# EAGLE schematic Speaker_shield (EAGLE 5.11)

## Sheet 1 of 3
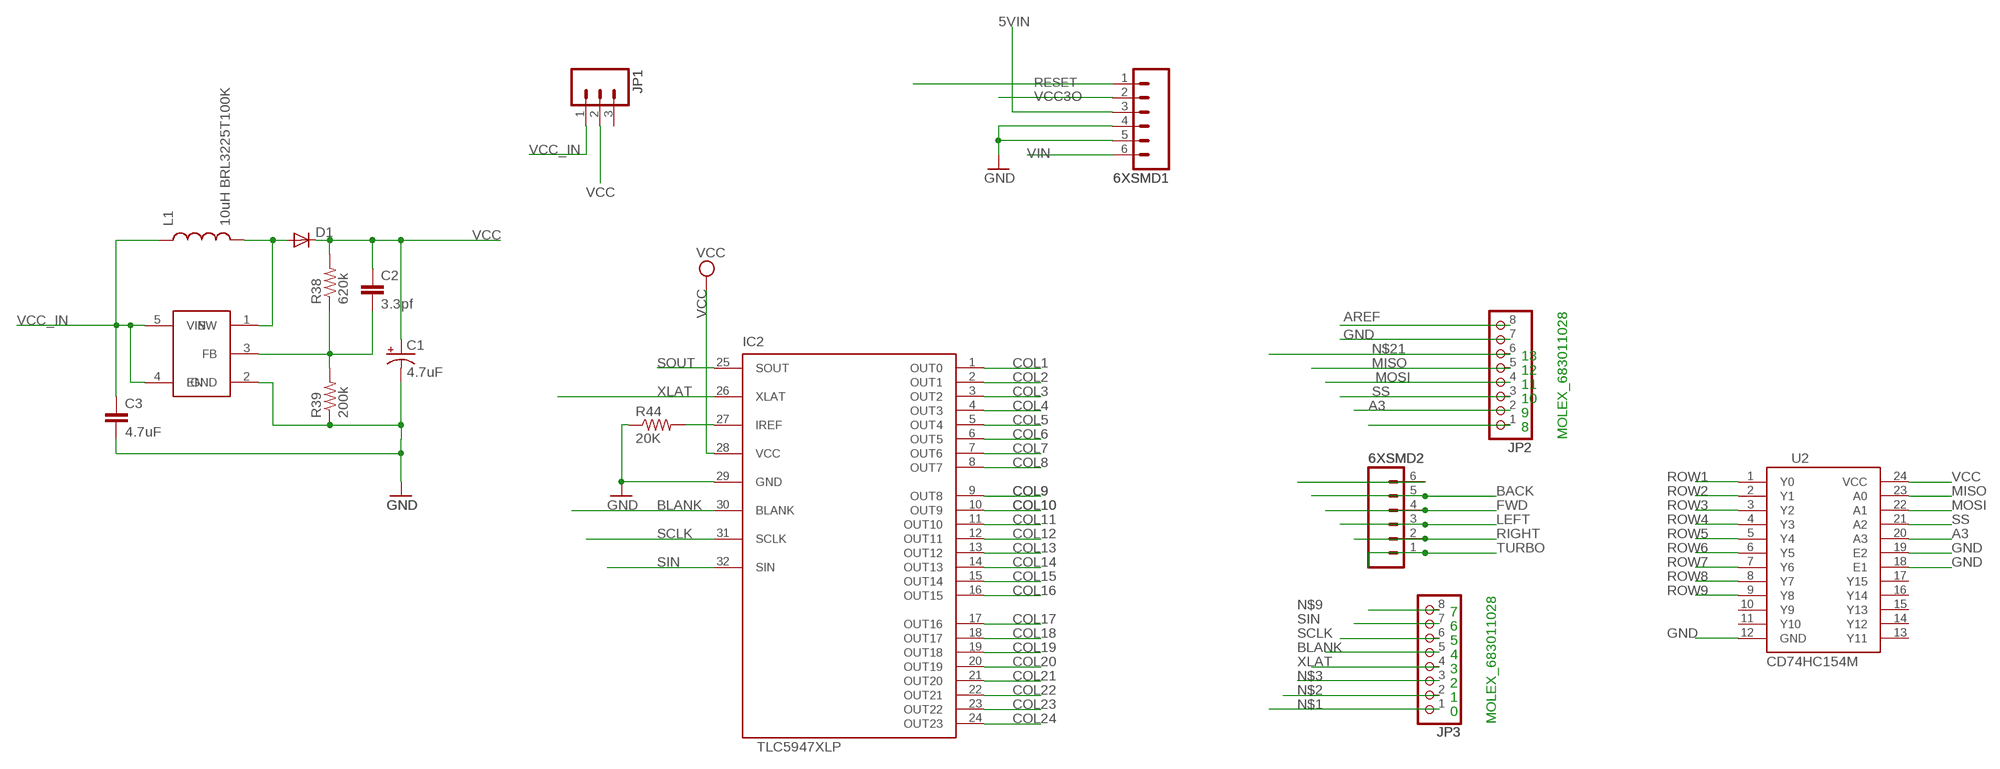
[diagram p0: schematic, sheet 1]

### Parts
6XSMD1  M06  [95293-401A06LF]
6XSMD2  M06  [95293-401A06LF]
C1  4.7uF  CAP_POL1206-KIT  [EIA3216-KIT]
C2  3.3pf  CAP0805  [0805]
C3  4.7uF  CAP0805  [0805]
D1  DIODESMA-ALT  [SMA-DIODE_ALT]
IC1  TPS61040  [SOT-23]
IC2  TLC5947XLP  [QFN32_XLP]
JP1  M03FEMALESMD  [1X3SMD]
JP2  PINHD-1X8SMD  [1X08SMD]
JP3  PINHD-1X8SMD  [1X08SMD]
L1  10uH BRL3225T100K  INDUCTOR1210  [1210]
R38  620k  RESISTOR0805-RES  [0805]
R39  200k  RESISTOR0805-RES  [0805]
R44  20K  R-US_R0805W  [R0805W]
U2  CD74HC154M  [SO-24DW]

### Nets
5VIN: 6XSMD1.3
A3: JP2.2 U2.20(A3)
AREF [aref]: JP2.8
BACK: 6XSMD2.5
BLANK: IC2.30(BLANK) JP3.5
COL1: IC2.1(OUT0) ; also sheet 2
COL2: IC2.2(OUT1) ; also sheet 2,3
COL3: IC2.3(OUT2) ; also sheet 2,3
COL4: IC2.4(OUT3) ; also sheet 2
COL5: IC2.5(OUT4) ; also sheet 2,3
COL6: IC2.6(OUT5) ; also sheet 2,3
COL7: IC2.7(OUT6) ; also sheet 2,3
COL8: IC2.8(OUT7) ; also sheet 2,3
COL9: IC2.9(OUT8) ; also sheet 2,3
COL10: IC2.10(OUT9) ; also sheet 2,3
COL11: IC2.11(OUT10) ; also sheet 2
COL12: IC2.12(OUT11) ; also sheet 2
COL13: IC2.13(OUT12) ; also sheet 2,3
COL14: IC2.14(OUT13) ; also sheet 2,3
COL15: IC2.15(OUT14) ; also sheet 2,3
COL16: IC2.16(OUT15) ; also sheet 2
COL17: IC2.17(OUT16)
COL18: IC2.18(OUT17)
COL19: IC2.19(OUT18)
COL20: IC2.20(OUT19)
COL21: IC2.21(OUT20)
COL22: IC2.22(OUT21)
COL23: IC2.23(OUT22)
COL24: IC2.24(OUT23)
FWD: 6XSMD2.4
GND: 6XSMD1.4 6XSMD1.5 C1.C(-) C3.2 IC1.2(GND) IC2.29(GND) JP2.7 R39.1 R44.1 U2.12(GND) U2.18(E1) U2.19(E2) ; also sheet 3
LEFT: 6XSMD2.3
MISO: JP2.5 U2.23(A0)
MOSI: JP2.4 U2.22(A1)
N$1: JP3.1
N$2: JP3.2
N$3: JP3.3
N$9: JP3.8
N$13: IC2.27(IREF) R44.2
N$15: D1.A IC1.1(SW) L1.2
N$17: C2.2 IC1.3(FB) R38.1 R39.2
N$21: JP2.6
N$24: 6XSMD2.6
N$25: JP2.1
RESET: 6XSMD1.1
RIGHT: 6XSMD2.2
ROW1: U2.1(Y0) ; also sheet 2
ROW2: U2.2(Y1) ; also sheet 2
ROW3: U2.3(Y2) ; also sheet 2
ROW4: U2.4(Y3) ; also sheet 2
ROW5: U2.5(Y4) ; also sheet 2
ROW6: U2.6(Y5) ; also sheet 2
ROW7: U2.7(Y6) ; also sheet 2
ROW8: U2.8(Y7) ; also sheet 2
ROW9: U2.9(Y8) ; also sheet 2
SCLK: IC2.31(SCLK) JP3.6
SIN: IC2.32(SIN) JP3.7
SOUT: IC2.25(SOUT)
SS: JP2.3 U2.21(A2)
TURBO: 6XSMD2.1
VCC: C1.A(+) C2.1 D1.C IC2.28(VCC) JP1.2 R38.2 U2.24(VCC) ; also sheet 2
VCC3O: 6XSMD1.2
VCC_IN: C3.1 IC1.4(EN) IC1.5(VIN) JP1.1 L1.1
VIN [power]: 6XSMD1.6
XLAT: IC2.26(XLAT) JP3.4
Unconnected: JP1.3 U2.10(Y9) U2.11(Y10) U2.13(Y11) U2.14(Y12) U2.15(Y13) U2.16(Y14) U2.17(Y15)

### Notes on the sheet
- 13
- 12
- 11
- 10
- 9
- 8
- MOLEX_683011028
- 7
- 6
- 5
- 4
- 3
- 2
- 1
- 0
- MOLEX_683011028

## Sheet 2 of 3
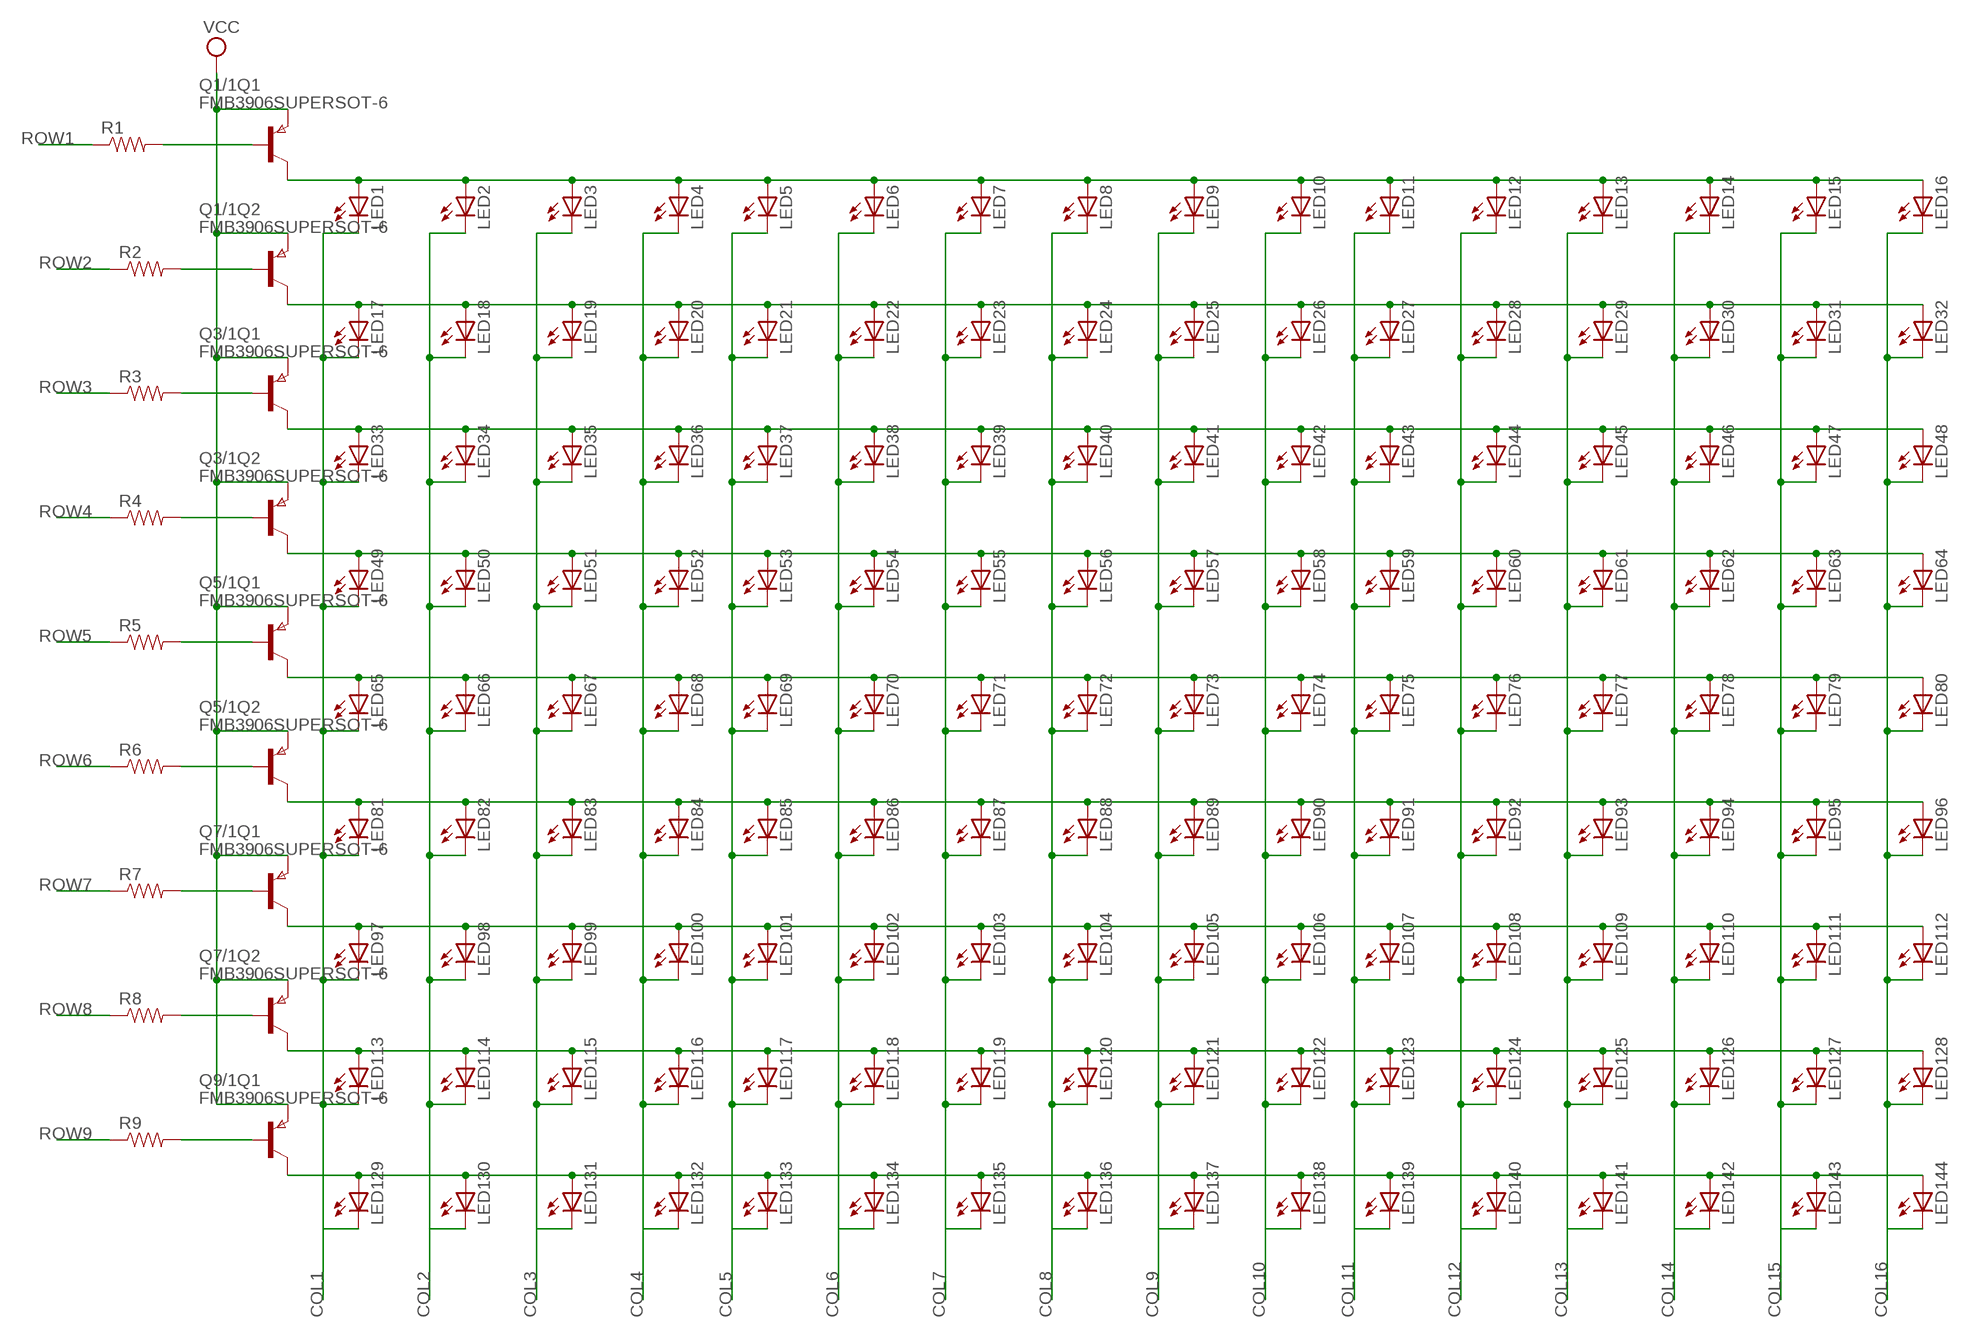
[diagram p1: schematic, sheet 2]

### Parts
LED1  NSL_SPARKFUN_LED1206  [NSL_SPARKFUN_LED-1206]
LED2  NSL_SPARKFUN_LED1206  [NSL_SPARKFUN_LED-1206]
LED3  NSL_SPARKFUN_LED1206  [NSL_SPARKFUN_LED-1206]
LED4  NSL_SPARKFUN_LED1206  [NSL_SPARKFUN_LED-1206]
LED5  NSL_SPARKFUN_LED1206  [NSL_SPARKFUN_LED-1206]
LED6  NSL_SPARKFUN_LED1206  [NSL_SPARKFUN_LED-1206]
LED7  NSL_SPARKFUN_LED1206  [NSL_SPARKFUN_LED-1206]
LED8  NSL_SPARKFUN_LED1206  [NSL_SPARKFUN_LED-1206]
LED9  NSL_SPARKFUN_LED1206  [NSL_SPARKFUN_LED-1206]
LED10  NSL_SPARKFUN_LED1206  [NSL_SPARKFUN_LED-1206]
LED11  NSL_SPARKFUN_LED1206  [NSL_SPARKFUN_LED-1206]
LED12  NSL_SPARKFUN_LED1206  [NSL_SPARKFUN_LED-1206]
LED13  NSL_SPARKFUN_LED1206  [NSL_SPARKFUN_LED-1206]
LED14  NSL_SPARKFUN_LED1206  [NSL_SPARKFUN_LED-1206]
LED15  NSL_SPARKFUN_LED1206  [NSL_SPARKFUN_LED-1206]
LED16  NSL_SPARKFUN_LED1206  [NSL_SPARKFUN_LED-1206]
LED17  NSL_SPARKFUN_LED1206  [NSL_SPARKFUN_LED-1206]
LED18  NSL_SPARKFUN_LED1206  [NSL_SPARKFUN_LED-1206]
LED19  NSL_SPARKFUN_LED1206  [NSL_SPARKFUN_LED-1206]
LED20  NSL_SPARKFUN_LED1206  [NSL_SPARKFUN_LED-1206]
LED21  NSL_SPARKFUN_LED1206  [NSL_SPARKFUN_LED-1206]
LED22  NSL_SPARKFUN_LED1206  [NSL_SPARKFUN_LED-1206]
LED23  NSL_SPARKFUN_LED1206  [NSL_SPARKFUN_LED-1206]
LED24  NSL_SPARKFUN_LED1206  [NSL_SPARKFUN_LED-1206]
LED25  NSL_SPARKFUN_LED1206  [NSL_SPARKFUN_LED-1206]
LED26  NSL_SPARKFUN_LED1206  [NSL_SPARKFUN_LED-1206]
LED27  NSL_SPARKFUN_LED1206  [NSL_SPARKFUN_LED-1206]
LED28  NSL_SPARKFUN_LED1206  [NSL_SPARKFUN_LED-1206]
LED29  NSL_SPARKFUN_LED1206  [NSL_SPARKFUN_LED-1206]
LED30  NSL_SPARKFUN_LED1206  [NSL_SPARKFUN_LED-1206]
LED31  NSL_SPARKFUN_LED1206  [NSL_SPARKFUN_LED-1206]
LED32  NSL_SPARKFUN_LED1206  [NSL_SPARKFUN_LED-1206]
LED33  NSL_SPARKFUN_LED1206  [NSL_SPARKFUN_LED-1206]
LED34  NSL_SPARKFUN_LED1206  [NSL_SPARKFUN_LED-1206]
LED35  NSL_SPARKFUN_LED1206  [NSL_SPARKFUN_LED-1206]
LED36  NSL_SPARKFUN_LED1206  [NSL_SPARKFUN_LED-1206]
LED37  NSL_SPARKFUN_LED1206  [NSL_SPARKFUN_LED-1206]
LED38  NSL_SPARKFUN_LED1206  [NSL_SPARKFUN_LED-1206]
LED39  NSL_SPARKFUN_LED1206  [NSL_SPARKFUN_LED-1206]
LED40  NSL_SPARKFUN_LED1206  [NSL_SPARKFUN_LED-1206]
LED41  NSL_SPARKFUN_LED1206  [NSL_SPARKFUN_LED-1206]
LED42  NSL_SPARKFUN_LED1206  [NSL_SPARKFUN_LED-1206]
LED43  NSL_SPARKFUN_LED1206  [NSL_SPARKFUN_LED-1206]
LED44  NSL_SPARKFUN_LED1206  [NSL_SPARKFUN_LED-1206]
LED45  NSL_SPARKFUN_LED1206  [NSL_SPARKFUN_LED-1206]
LED46  NSL_SPARKFUN_LED1206  [NSL_SPARKFUN_LED-1206]
LED47  NSL_SPARKFUN_LED1206  [NSL_SPARKFUN_LED-1206]
LED48  NSL_SPARKFUN_LED1206  [NSL_SPARKFUN_LED-1206]
LED49  NSL_SPARKFUN_LED1206  [NSL_SPARKFUN_LED-1206]
LED50  NSL_SPARKFUN_LED1206  [NSL_SPARKFUN_LED-1206]
LED51  NSL_SPARKFUN_LED1206  [NSL_SPARKFUN_LED-1206]
LED52  NSL_SPARKFUN_LED1206  [NSL_SPARKFUN_LED-1206]
LED53  NSL_SPARKFUN_LED1206  [NSL_SPARKFUN_LED-1206]
LED54  NSL_SPARKFUN_LED1206  [NSL_SPARKFUN_LED-1206]
LED55  NSL_SPARKFUN_LED1206  [NSL_SPARKFUN_LED-1206]
LED56  NSL_SPARKFUN_LED1206  [NSL_SPARKFUN_LED-1206]
LED57  NSL_SPARKFUN_LED1206  [NSL_SPARKFUN_LED-1206]
LED58  NSL_SPARKFUN_LED1206  [NSL_SPARKFUN_LED-1206]
LED59  NSL_SPARKFUN_LED1206  [NSL_SPARKFUN_LED-1206]
LED60  NSL_SPARKFUN_LED1206  [NSL_SPARKFUN_LED-1206]
LED61  NSL_SPARKFUN_LED1206  [NSL_SPARKFUN_LED-1206]
LED62  NSL_SPARKFUN_LED1206  [NSL_SPARKFUN_LED-1206]
LED63  NSL_SPARKFUN_LED1206  [NSL_SPARKFUN_LED-1206]
LED64  NSL_SPARKFUN_LED1206  [NSL_SPARKFUN_LED-1206]
LED65  NSL_SPARKFUN_LED1206  [NSL_SPARKFUN_LED-1206]
LED66  NSL_SPARKFUN_LED1206  [NSL_SPARKFUN_LED-1206]
LED67  NSL_SPARKFUN_LED1206  [NSL_SPARKFUN_LED-1206]
LED68  NSL_SPARKFUN_LED1206  [NSL_SPARKFUN_LED-1206]
LED69  NSL_SPARKFUN_LED1206  [NSL_SPARKFUN_LED-1206]
LED70  NSL_SPARKFUN_LED1206  [NSL_SPARKFUN_LED-1206]
LED71  NSL_SPARKFUN_LED1206  [NSL_SPARKFUN_LED-1206]
LED72  NSL_SPARKFUN_LED1206  [NSL_SPARKFUN_LED-1206]
LED73  NSL_SPARKFUN_LED1206  [NSL_SPARKFUN_LED-1206]
LED74  NSL_SPARKFUN_LED1206  [NSL_SPARKFUN_LED-1206]
LED75  NSL_SPARKFUN_LED1206  [NSL_SPARKFUN_LED-1206]
LED76  NSL_SPARKFUN_LED1206  [NSL_SPARKFUN_LED-1206]
LED77  NSL_SPARKFUN_LED1206  [NSL_SPARKFUN_LED-1206]
LED78  NSL_SPARKFUN_LED1206  [NSL_SPARKFUN_LED-1206]
LED79  NSL_SPARKFUN_LED1206  [NSL_SPARKFUN_LED-1206]
LED80  NSL_SPARKFUN_LED1206  [NSL_SPARKFUN_LED-1206]
LED81  NSL_SPARKFUN_LED1206  [NSL_SPARKFUN_LED-1206]
LED82  NSL_SPARKFUN_LED1206  [NSL_SPARKFUN_LED-1206]
LED83  NSL_SPARKFUN_LED1206  [NSL_SPARKFUN_LED-1206]
LED84  NSL_SPARKFUN_LED1206  [NSL_SPARKFUN_LED-1206]
LED85  NSL_SPARKFUN_LED1206  [NSL_SPARKFUN_LED-1206]
LED86  NSL_SPARKFUN_LED1206  [NSL_SPARKFUN_LED-1206]
LED87  NSL_SPARKFUN_LED1206  [NSL_SPARKFUN_LED-1206]
LED88  NSL_SPARKFUN_LED1206  [NSL_SPARKFUN_LED-1206]
LED89  NSL_SPARKFUN_LED1206  [NSL_SPARKFUN_LED-1206]
LED90  NSL_SPARKFUN_LED1206  [NSL_SPARKFUN_LED-1206]
LED91  NSL_SPARKFUN_LED1206  [NSL_SPARKFUN_LED-1206]
LED92  NSL_SPARKFUN_LED1206  [NSL_SPARKFUN_LED-1206]
LED93  NSL_SPARKFUN_LED1206  [NSL_SPARKFUN_LED-1206]
LED94  NSL_SPARKFUN_LED1206  [NSL_SPARKFUN_LED-1206]
LED95  NSL_SPARKFUN_LED1206  [NSL_SPARKFUN_LED-1206]
LED96  NSL_SPARKFUN_LED1206  [NSL_SPARKFUN_LED-1206]
LED97  NSL_SPARKFUN_LED1206  [NSL_SPARKFUN_LED-1206]
LED98  NSL_SPARKFUN_LED1206  [NSL_SPARKFUN_LED-1206]
LED99  NSL_SPARKFUN_LED1206  [NSL_SPARKFUN_LED-1206]
LED100  NSL_SPARKFUN_LED1206  [NSL_SPARKFUN_LED-1206]
LED101  NSL_SPARKFUN_LED1206  [NSL_SPARKFUN_LED-1206]
LED102  NSL_SPARKFUN_LED1206  [NSL_SPARKFUN_LED-1206]
LED103  NSL_SPARKFUN_LED1206  [NSL_SPARKFUN_LED-1206]
LED104  NSL_SPARKFUN_LED1206  [NSL_SPARKFUN_LED-1206]
LED105  NSL_SPARKFUN_LED1206  [NSL_SPARKFUN_LED-1206]
LED106  NSL_SPARKFUN_LED1206  [NSL_SPARKFUN_LED-1206]
LED107  NSL_SPARKFUN_LED1206  [NSL_SPARKFUN_LED-1206]
LED108  NSL_SPARKFUN_LED1206  [NSL_SPARKFUN_LED-1206]
LED109  NSL_SPARKFUN_LED1206  [NSL_SPARKFUN_LED-1206]
LED110  NSL_SPARKFUN_LED1206  [NSL_SPARKFUN_LED-1206]
LED111  NSL_SPARKFUN_LED1206  [NSL_SPARKFUN_LED-1206]
LED112  NSL_SPARKFUN_LED1206  [NSL_SPARKFUN_LED-1206]
LED113  NSL_SPARKFUN_LED1206  [NSL_SPARKFUN_LED-1206]
LED114  NSL_SPARKFUN_LED1206  [NSL_SPARKFUN_LED-1206]
LED115  NSL_SPARKFUN_LED1206  [NSL_SPARKFUN_LED-1206]
LED116  NSL_SPARKFUN_LED1206  [NSL_SPARKFUN_LED-1206]
LED117  NSL_SPARKFUN_LED1206  [NSL_SPARKFUN_LED-1206]
LED118  NSL_SPARKFUN_LED1206  [NSL_SPARKFUN_LED-1206]
LED119  NSL_SPARKFUN_LED1206  [NSL_SPARKFUN_LED-1206]
LED120  NSL_SPARKFUN_LED1206  [NSL_SPARKFUN_LED-1206]
LED121  NSL_SPARKFUN_LED1206  [NSL_SPARKFUN_LED-1206]
LED122  NSL_SPARKFUN_LED1206  [NSL_SPARKFUN_LED-1206]
LED123  NSL_SPARKFUN_LED1206  [NSL_SPARKFUN_LED-1206]
LED124  NSL_SPARKFUN_LED1206  [NSL_SPARKFUN_LED-1206]
LED125  NSL_SPARKFUN_LED1206  [NSL_SPARKFUN_LED-1206]
LED126  NSL_SPARKFUN_LED1206  [NSL_SPARKFUN_LED-1206]
LED127  NSL_SPARKFUN_LED1206  [NSL_SPARKFUN_LED-1206]
LED128  NSL_SPARKFUN_LED1206  [NSL_SPARKFUN_LED-1206]
LED129  NSL_SPARKFUN_LED1206  [NSL_SPARKFUN_LED-1206]
LED130  NSL_SPARKFUN_LED1206  [NSL_SPARKFUN_LED-1206]
LED131  NSL_SPARKFUN_LED1206  [NSL_SPARKFUN_LED-1206]
LED132  NSL_SPARKFUN_LED1206  [NSL_SPARKFUN_LED-1206]
LED133  NSL_SPARKFUN_LED1206  [NSL_SPARKFUN_LED-1206]
LED134  NSL_SPARKFUN_LED1206  [NSL_SPARKFUN_LED-1206]
LED135  NSL_SPARKFUN_LED1206  [NSL_SPARKFUN_LED-1206]
LED136  NSL_SPARKFUN_LED1206  [NSL_SPARKFUN_LED-1206]
LED137  NSL_SPARKFUN_LED1206  [NSL_SPARKFUN_LED-1206]
LED138  NSL_SPARKFUN_LED1206  [NSL_SPARKFUN_LED-1206]
LED139  NSL_SPARKFUN_LED1206  [NSL_SPARKFUN_LED-1206]
LED140  NSL_SPARKFUN_LED1206  [NSL_SPARKFUN_LED-1206]
LED141  NSL_SPARKFUN_LED1206  [NSL_SPARKFUN_LED-1206]
LED142  NSL_SPARKFUN_LED1206  [NSL_SPARKFUN_LED-1206]
LED143  NSL_SPARKFUN_LED1206  [NSL_SPARKFUN_LED-1206]
LED144  NSL_SPARKFUN_LED1206  [NSL_SPARKFUN_LED-1206]
Q1/1  FMB3906SUPERSOT-6  [SSOT-6]
Q3/1  FMB3906SUPERSOT-6  [SSOT-6]
Q5/1  FMB3906SUPERSOT-6  [SSOT-6]
Q7/1  FMB3906SUPERSOT-6  [SSOT-6]
Q9/1  FMB3906SUPERSOT-6  [SSOT-6]
R1  SPARKFUN_RESISTOR0603-RES  [SPARKFUN_0603-RES]
R2  SPARKFUN_RESISTOR0603-RES  [SPARKFUN_0603-RES]
R3  SPARKFUN_RESISTOR0603-RES  [SPARKFUN_0603-RES]
R4  SPARKFUN_RESISTOR0603-RES  [SPARKFUN_0603-RES]
R5  SPARKFUN_RESISTOR0603-RES  [SPARKFUN_0603-RES]
R6  SPARKFUN_RESISTOR0603-RES  [SPARKFUN_0603-RES]
R7  SPARKFUN_RESISTOR0603-RES  [SPARKFUN_0603-RES]
R8  SPARKFUN_RESISTOR0603-RES  [SPARKFUN_0603-RES]
R9  SPARKFUN_RESISTOR0603-RES  [SPARKFUN_0603-RES]

### Nets
COL1: LED1.C LED17.C LED33.C LED49.C LED65.C LED81.C LED97.C LED113.C LED129.C ; also sheet 1
COL2: LED2.C LED18.C LED34.C LED50.C LED66.C LED82.C LED98.C LED114.C LED130.C ; also sheet 1,3
COL3: LED3.C LED19.C LED35.C LED51.C LED67.C LED83.C LED99.C LED115.C LED131.C ; also sheet 1,3
COL4: LED4.C LED20.C LED36.C LED52.C LED68.C LED84.C LED100.C LED116.C LED132.C ; also sheet 1
COL5: LED5.C LED21.C LED37.C LED53.C LED69.C LED85.C LED101.C LED117.C LED133.C ; also sheet 1,3
COL6: LED6.C LED22.C LED38.C LED54.C LED70.C LED86.C LED102.C LED118.C LED134.C ; also sheet 1,3
COL7: LED7.C LED23.C LED39.C LED55.C LED71.C LED87.C LED103.C LED119.C LED135.C ; also sheet 1,3
COL8: LED8.C LED24.C LED40.C LED56.C LED72.C LED88.C LED104.C LED120.C LED136.C ; also sheet 1,3
COL9: LED9.C LED25.C LED41.C LED57.C LED73.C LED89.C LED105.C LED121.C LED137.C ; also sheet 1,3
COL10: LED10.C LED26.C LED42.C LED58.C LED74.C LED90.C LED106.C LED122.C LED138.C ; also sheet 1,3
COL11: LED11.C LED27.C LED43.C LED59.C LED75.C LED91.C LED107.C LED123.C LED139.C ; also sheet 1
COL12: LED12.C LED28.C LED44.C LED60.C LED76.C LED92.C LED108.C LED124.C LED140.C ; also sheet 1
COL13: LED13.C LED29.C LED45.C LED61.C LED77.C LED93.C LED109.C LED125.C LED141.C ; also sheet 1,3
COL14: LED14.C LED30.C LED46.C LED62.C LED78.C LED94.C LED110.C LED126.C LED142.C ; also sheet 1,3
COL15: LED15.C LED31.C LED47.C LED63.C LED79.C LED95.C LED111.C LED127.C LED143.C ; also sheet 1,3
COL16: LED16.C LED32.C LED48.C LED64.C LED80.C LED96.C LED112.C LED128.C LED144.C ; also sheet 1
LINE1: LED1.A LED2.A LED3.A LED4.A LED5.A LED6.A LED7.A LED8.A LED9.A LED10.A LED11.A LED12.A LED13.A LED14.A LED15.A LED16.A Q1/1.6(Q1:C)
LINE2: LED17.A LED18.A LED19.A LED20.A LED21.A LED22.A LED23.A LED24.A LED25.A LED26.A LED27.A LED28.A LED29.A LED30.A LED31.A LED32.A Q1/1.4(Q2:C)
LINE3: LED33.A LED34.A LED35.A LED36.A LED37.A LED38.A LED39.A LED40.A LED41.A LED42.A LED43.A LED44.A LED45.A LED46.A LED47.A LED48.A Q3/1.6(Q1:C)
LINE4: LED49.A LED50.A LED51.A LED52.A LED53.A LED54.A LED55.A LED56.A LED57.A LED58.A LED59.A LED60.A LED61.A LED62.A LED63.A LED64.A Q3/1.4(Q2:C)
LINE5: LED65.A LED66.A LED67.A LED68.A LED69.A LED70.A LED71.A LED72.A LED73.A LED74.A LED75.A LED76.A LED77.A LED78.A LED79.A LED80.A Q5/1.6(Q1:C)
LINE6: LED81.A LED82.A LED83.A LED84.A LED85.A LED86.A LED87.A LED88.A LED89.A LED90.A LED91.A LED92.A LED93.A LED94.A LED95.A LED96.A Q5/1.4(Q2:C)
LINE7: LED97.A LED98.A LED99.A LED100.A LED101.A LED102.A LED103.A LED104.A LED105.A LED106.A LED107.A LED108.A LED109.A LED110.A LED111.A LED112.A Q7/1.6(Q1:C)
LINE8: LED113.A LED114.A LED115.A LED116.A LED117.A LED118.A LED119.A LED120.A LED121.A LED122.A LED123.A LED124.A LED125.A LED126.A LED127.A LED128.A Q7/1.4(Q2:C)
LINE9: LED129.A LED130.A LED131.A LED132.A LED133.A LED134.A LED135.A LED136.A LED137.A LED138.A LED139.A LED140.A LED141.A LED142.A LED143.A LED144.A Q9/1.6(Q1:C)
N$4: Q1/1.1(Q1:B) R1.2
N$6: Q1/1.3(Q2:B) R2.2
N$7: Q3/1.1(Q1:B) R3.2
N$10: Q3/1.3(Q2:B) R4.2
N$11: Q5/1.1(Q1:B) R5.2
N$12: Q5/1.3(Q2:B) R6.2
N$14: Q7/1.1(Q1:B) R7.2
N$16: Q7/1.3(Q2:B) R8.2
N$18: Q9/1.1(Q1:B) R9.2
ROW1: R1.1 ; also sheet 1
ROW2: R2.1 ; also sheet 1
ROW3: R3.1 ; also sheet 1
ROW4: R4.1 ; also sheet 1
ROW5: R5.1 ; also sheet 1
ROW6: R6.1 ; also sheet 1
ROW7: R7.1 ; also sheet 1
ROW8: R8.1 ; also sheet 1
ROW9: R9.1 ; also sheet 1
VCC: Q1/1.2(Q2:E) Q1/1.5(Q1:E) Q3/1.2(Q2:E) Q3/1.5(Q1:E) Q5/1.2(Q2:E) Q5/1.5(Q1:E) Q7/1.2(Q2:E) Q7/1.5(Q1:E) Q9/1.5(Q1:E) ; also sheet 1
Unconnected: Q9/1.2(Q2:E) Q9/1.3(Q2:B) Q9/1.4(Q2:C)

## Sheet 3 of 3
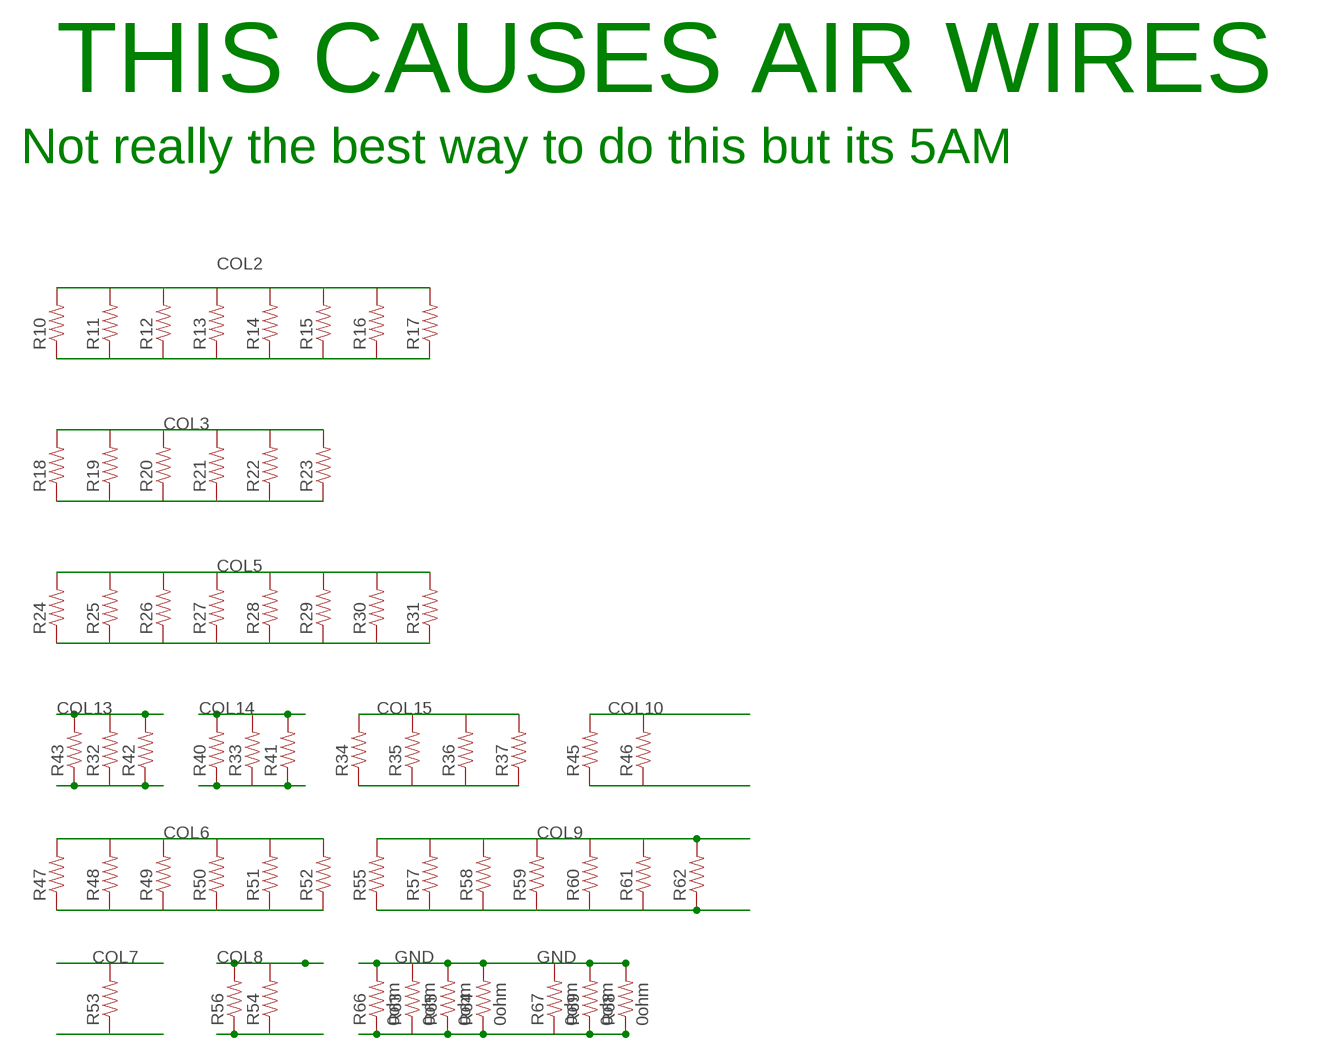
[diagram p2: schematic, sheet 3]

### Parts
R10  RESISTOR0805-RES  [0805]
R11  RESISTOR0805-RES  [0805]
R12  RESISTOR0805-RES  [0805]
R13  RESISTOR0805-RES  [0805]
R14  RESISTOR0805-RES  [0805]
R15  RESISTOR0805-RES  [0805]
R16  RESISTOR0805-RES  [0805]
R17  RESISTOR0805-RES  [0805]
R18  RESISTOR0805-RES  [0805]
R19  RESISTOR0805-RES  [0805]
R20  RESISTOR0805-RES  [0805]
R21  RESISTOR0805-RES  [0805]
R22  RESISTOR0805-RES  [0805]
R23  RESISTOR0805-RES  [0805]
R24  RESISTOR0805-RES  [0805]
R25  RESISTOR0805-RES  [0805]
R26  RESISTOR0805-RES  [0805]
R27  RESISTOR0805-RES  [0805]
R28  RESISTOR0805-RES  [0805]
R29  RESISTOR0805-RES  [0805]
R30  RESISTOR0805-RES  [0805]
R31  RESISTOR0805-RES  [0805]
R32  RESISTOR0805-RES  [0805]
R33  RESISTOR0805-RES  [0805]
R34  RESISTOR0805-RES  [0805]
R35  RESISTOR0805-RES  [0805]
R36  RESISTOR0805-RES  [0805]
R37  RESISTOR0805-RES  [0805]
R40  RESISTOR0805-RES  [0805]
R41  RESISTOR0805-RES  [0805]
R42  RESISTOR0805-RES  [0805]
R43  RESISTOR0805-RES  [0805]
R45  RESISTOR0805-RES  [0805]
R46  RESISTOR0805-RES  [0805]
R47  RESISTOR0805-RES  [0805]
R48  RESISTOR0805-RES  [0805]
R49  RESISTOR0805-RES  [0805]
R50  RESISTOR0805-RES  [0805]
R51  RESISTOR0805-RES  [0805]
R52  RESISTOR0805-RES  [0805]
R53  RESISTOR0805-RES  [0805]
R54  RESISTOR0805-RES  [0805]
R55  RESISTOR0805-RES  [0805]
R56  RESISTOR0805-RES  [0805]
R57  RESISTOR0805-RES  [0805]
R58  RESISTOR0805-RES  [0805]
R59  RESISTOR0805-RES  [0805]
R60  RESISTOR0805-RES  [0805]
R61  RESISTOR0805-RES  [0805]
R62  RESISTOR0805-RES  [0805]
R63  0ohm  RESISTOR0805-RES  [0805]
R64  0ohm  RESISTOR0805-RES  [0805]
R65  0ohm  RESISTOR0805-RES  [0805]
R66  0ohm  RESISTOR0805-RES  [0805]
R67  0ohm  RESISTOR0805-RES  [0805]
R68  0ohm  RESISTOR0805-RES  [0805]
R69  0ohm  RESISTOR0805-RES  [0805]

### Nets
COL2: R10.1 R10.2 R11.1 R11.2 R12.1 R12.2 R13.1 R13.2 R14.1 R14.2 R15.1 R15.2 R16.1 R16.2 R17.1 R17.2 ; also sheet 1,2
COL3: R18.1 R18.2 R19.1 R19.2 R20.1 R20.2 R21.1 R21.2 R22.1 R22.2 R23.1 R23.2 ; also sheet 1,2
COL5: R24.1 R24.2 R25.1 R25.2 R26.1 R26.2 R27.1 R27.2 R28.1 R28.2 R29.1 R29.2 R30.1 R30.2 R31.1 R31.2 ; also sheet 1,2
COL6: R47.1 R47.2 R48.1 R48.2 R49.1 R49.2 R50.1 R50.2 R51.1 R51.2 R52.1 R52.2 ; also sheet 1,2
COL7: R53.1 R53.2 ; also sheet 1,2
COL8: R54.1 R54.2 R56.1 R56.2 ; also sheet 1,2
COL9: R55.1 R55.2 R57.1 R57.2 R58.1 R58.2 R59.1 R59.2 R60.1 R60.2 R61.1 R61.2 R62.1 R62.2 ; also sheet 1,2
COL10: R45.1 R45.2 R46.1 R46.2 ; also sheet 1,2
COL13: R32.1 R32.2 R42.1 R42.2 R43.1 R43.2 ; also sheet 1,2
COL14: R33.1 R33.2 R40.1 R40.2 R41.1 R41.2 ; also sheet 1,2
COL15: R34.1 R34.2 R35.1 R35.2 R36.1 R36.2 R37.1 R37.2 ; also sheet 1,2
GND: R63.1 R63.2 R64.1 R64.2 R65.1 R65.2 R66.1 R66.2 R67.1 R67.2 R68.1 R68.2 R69.1 R69.2 ; also sheet 1

### Notes on the sheet
- THIS CAUSES AIR WIRES
- Not really the best way to do this but its 5AM

## Library data of the parts
6XSMD1 6XSMD2 = Speaker_shield:M06
C1 = SparkFun:CAP_POL: Capacitor Polarized These are standard SMD and PTH capacitors. Normally 10uF, 47uF, and 100uF in electrolytic and tantalum varieties. Always verify the external diameter of the through hole cap, it varies with capacity, voltage, and manufacturer. The EIA devices should be standard.
C2 C3 = SparkFun:CAP: Capacitor Standard 0603 ceramic capacitor, and 0.1" leaded capacitor.
D1 = SparkFun:DIODE: Diode These are standard reverse protection diodes and small signal diodes. SMA package can handle up to about 1A. SOD-323 can handle about 200mA. What the SOD-323 package when ordering, there are some mfgs out there that are 5-pin packages.
IC1 = Speaker_shield:TPS61040
IC2 = slice_noshift:TLC5947
JP1 = Speaker_shield:M03: Header 3 Standard 3-pin 0.1" header. Use with straight break away headers (SKU : PRT-00116), right angle break away headers (PRT-00553), swiss pins (PRT-00743), machine pins (PRT-00117), and female headers (PRT-00115). Molex polarized connector foot print use with SKU : PRT-08232 with associated crimp pins and housings.
JP2 JP3 = Speaker_shield:PINHD-1X8: PIN HEADER
L1 = SparkFun:INDUCTOR: Inductors Basic Inductor/Choke - 0603 and 1206. Footprints are not proven and vary greatly between part numbers.
LED1-LED144 = Nullspace:NSL_SPARKFUN_LED: LEDs Standard schematic elements and footprints for 5mm, 3mm, 1206, and 0603 sized LEDs. 5mm - Spark Fun Electronics SKU : COM-00529 (and others)
Q1/1 Q3/1 Q5/1 Q7/1 Q9/1 = fairchild-semic:FMB3906: FMB3906 This device is designed for general purpose amplifier and switching applications at collector currents of 10 µA to 100 mA
R1-R9 = Nullspace:SPARKFUN_RESISTOR: Resistor Basic schematic elements and footprints for 0603, 1206, and PTH 1/10th watt (small) resistors.
R10-R43 R45-R69 = SparkFun:RESISTOR: Resistor Basic schematic elements and footprints for 0603, 1206, and PTH resistors.
R44 = rcl:R-US_: RESISTOR, American symbol
U2 = SparkFun:CD74HC154M: High-Speed CMOS Logic 4- to 16-Line Decoder/Demultiplexer

## Net classes
1 power: width 0.61 mm, drill 0.508 mm, clearance 0.152 mm
2 gnd: width 0.305 mm, drill 0.508 mm, clearance 0.152 mm
3 usbvcc: width 0.508 mm, drill 0.508 mm, clearance 0.152 mm
4 aref: width 0.406 mm